# Altium project THYRISTOR POWER REGULATOR.PrjPCB
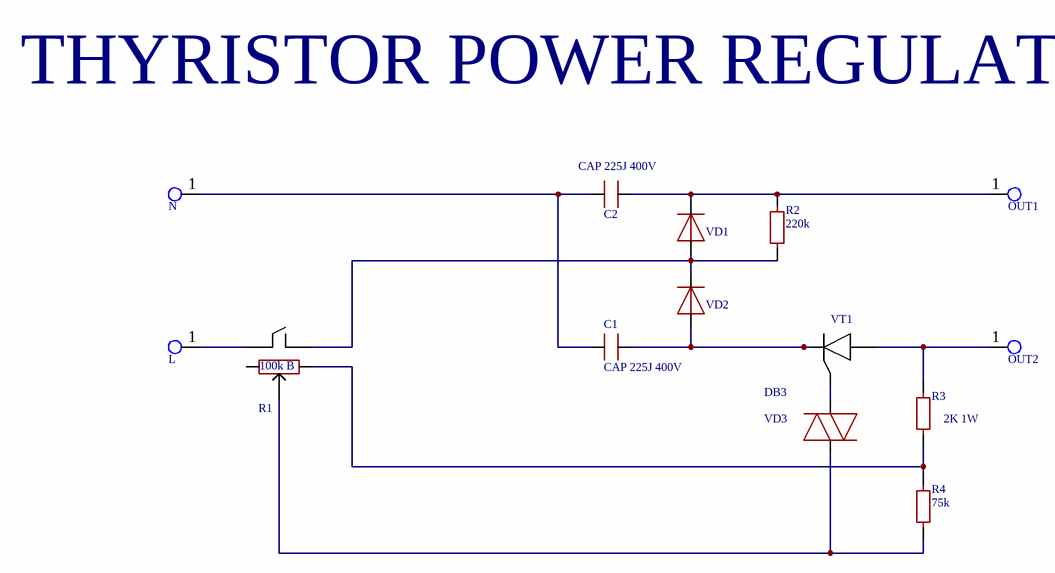
[diagram p0: THYRISTOR POWER REGULATOR.SchDoc]
1 sheet, 14 parts. Net scope: global (net labels, ports and power ports of the same name join across sheets).
Board file: THYRISTOR POWER REGULATOR.PcbDoc

## Sheet THYRISTOR POWER REGULATOR.SchDoc
size A4

### Parts
C1  CAP 225J 400V  [CAP 225J 400V]
C2  CAP 225J 400V  [CAP 225J 400V]
L  Test_Point_PCB  [Test_Point]  (value not drawn)
N  Test_Point_PCB  [Test_Point]  (value not drawn)
OUT1  Test_Point_PCB  [Test_Point]  (value not drawn)
OUT2  Test_Point_PCB  [Test_Point]  (value not drawn)
R1  100k B  [RES_VAR]
R2  220k  [RES-1206]
R3  2K 1W  [RES-2512]
R4  75k  [RES-1206]
VD1  DIODE  [DO-214AA]  (value not drawn)
VD2  DIODE  [DO-214AA]  (value not drawn)
VD3  DB3  [DB3]
VT1  TYN412  [TO-220-3]  (value not drawn)

### Nets
NetC1_1: C1.1(C) VD2.2(A) VT1.1
NetC1_2: C1.2(A) C2.2(A) N.1(G9)
NetC2_1: C2.1(C) OUT1.1(G9) R2.1 VD1.1(C)
NetL_1: L.1(G9) R1.5
NetOUT2_1: OUT2.1(G9) R3.2 VT1.2
NetR1_1: R1.1 R3.1 R4.1
NetR1_2: R1.2 R4.2 VD3.2(A)
NetR1_4: R1.4 R2.2 VD1.2(A) VD2.1(C)
NetVD3_1: VD3.1(C) VT1.3

Not connected (* = marked no-connect by the designer): R1 3

### Notes on the sheet
- THYRISTOR POWER REGULATOR

### Library data of the parts
L N OUT1 OUT2 = TP_PCB?: Test_Point
R1 = RES_VAR
R2-R4 = RES-CONST
VD1 VD2 = B340B-13-F: Diode Schottky 40 V 3A Surface Mount SMB; Manufacturer: Diodes Incorporated; ID: D-00025; In Stock: 0; Part Number: B340B-13-F; Value: B340B-13-F; ComponentLink1Description: Database URL; ComponentLink1URL: http://el.udtech.dev/component/1956/detail
VD3 = DIODE